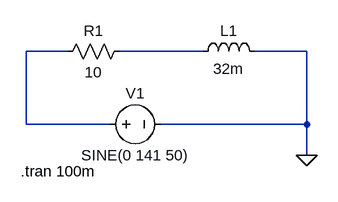
[diagram p0: schematic RL_AC Transients.asc]
RL_AC Transients.asc, the LTspice schematic file:
Version 4.1
SHEET 1 880 680
WIRE 112 112 48 112
WIRE 320 112 192 112
WIRE 480 112 400 112
WIRE 48 224 48 112
WIRE 176 224 48 224
WIRE 480 224 480 112
WIRE 480 224 256 224
WIRE 480 272 480 224
FLAG 480 272 0
SYMBOL res 96 128 R270
WINDOW 0 32 56 VTop 2
WINDOW 3 0 56 VBottom 2
SYMATTR InstName R1
SYMATTR Value 10
SYMBOL ind 304 128 R270
WINDOW 0 32 56 VTop 2
WINDOW 3 5 56 VBottom 2
SYMATTR InstName L1
SYMATTR Value 32m
SYMBOL voltage 160 224 R270
WINDOW 0 32 56 VTop 2
WINDOW 3 -32 56 VBottom 2
WINDOW 123 0 0 Left 0
WINDOW 39 0 0 Left 0
SYMATTR InstName V1
SYMATTR Value SINE(0 141 50)
TEXT 40 296 Left 2 !.tran 100m

The netlist it stands for:
* RL_AC Transients.asc
R1 N001 N002 10
L1 N002 0 32m
V1 N001 0 SINE(0 141 50)
.tran 100m
.backanno
.end